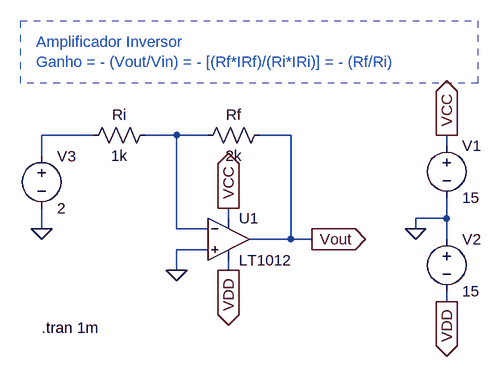
[diagram p0: schematic OpAmp_Inv.asc]
OpAmp_Inv.asc, the LTspice schematic file:
Version 4
SHEET 1 880 680
WIRE 32 16 -48 16
WIRE 160 16 112 16
WIRE 208 16 160 16
WIRE 336 16 288 16
WIRE 576 32 576 16
WIRE -48 48 -48 16
WIRE 240 144 240 128
WIRE 576 144 576 112
WIRE 576 144 528 144
WIRE -48 160 -48 128
WIRE 160 160 160 16
WIRE 208 160 160 160
WIRE 528 160 528 144
WIRE 336 176 336 16
WIRE 336 176 272 176
WIRE 368 176 336 176
WIRE 576 176 576 144
WIRE 208 192 160 192
WIRE 160 224 160 192
WIRE 240 224 240 208
WIRE 576 272 576 256
FLAG 528 160 0
FLAG 576 16 VCC
IOPIN 576 16 Out
FLAG 576 272 VDD
IOPIN 576 272 Out
FLAG 240 128 VCC
IOPIN 240 128 Out
FLAG 240 224 VDD
IOPIN 240 224 Out
FLAG 160 224 0
FLAG 368 176 Vout
IOPIN 368 176 Out
FLAG -48 160 0
SYMBOL Opamps\\LT1012 240 112 R0
SYMATTR InstName U1
SYMBOL voltage 576 16 R0
SYMATTR InstName V1
SYMATTR Value 15
SYMBOL voltage 576 160 R0
SYMATTR InstName V2
SYMATTR Value 15
SYMBOL res 128 0 R90
WINDOW 0 0 56 VBottom 2
WINDOW 3 32 56 VTop 2
SYMATTR InstName Ri
SYMATTR Value 1k
SYMBOL res 304 0 R90
WINDOW 0 0 56 VBottom 2
WINDOW 3 32 56 VTop 2
SYMATTR InstName Rf
SYMATTR Value 2k
SYMBOL voltage -48 32 R0
SYMATTR InstName V3
SYMATTR Value 2
TEXT -56 -128 Left 2 ;Amplificador Inversor\nGanho = - (Vout/Vin) = - [(Rf*IRf)/(Ri*IRi)] = - (Rf/Ri)
TEXT -48 312 Left 2 !.tran 1m
RECTANGLE Normal 624 -64 -80 -160 2

The netlist it stands for:
* OpAmp_Inv.asc
XU1 0 N002 VCC VDD Vout LT1012  ; pins In+ In- V+ V- OUT
V1 VCC 0 15
V2 0 VDD 15
Ri N002 N001 1k
Rf Vout N002 2k
V3 N001 0 2
* Amplificador Inversor
* Ganho = - (Vout/Vin) = - [(Rf*IRf)/(Ri*IRi)] = - (Rf/Ri)
.tran 1m
.backanno
.end